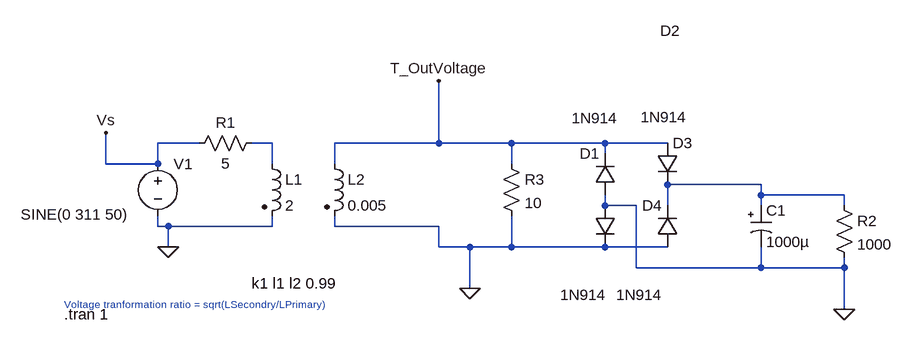
[diagram p0: schematic powersupply12V.asc]
powersupply12V.asc, the LTspice schematic file:
Version 4
SHEET 1 1608 680
WIRE 48 96 -16 96
WIRE 160 96 128 96
WIRE 416 96 416 0
WIRE 416 96 256 96
WIRE 528 96 416 96
WIRE 672 96 528 96
WIRE 768 96 672 96
WIRE 672 112 672 96
WIRE -96 128 -96 80
WIRE -16 128 -16 96
WIRE -16 128 -96 128
WIRE 160 128 160 96
WIRE 256 128 256 96
WIRE 528 128 528 96
WIRE 912 160 768 160
WIRE 912 176 912 160
WIRE 1040 176 912 176
WIRE 672 192 672 176
WIRE 720 192 672 192
WIRE 768 192 768 160
WIRE 912 192 912 176
WIRE 1040 192 1040 176
WIRE -16 224 -16 208
WIRE 0 224 -16 224
WIRE 160 224 160 208
WIRE 160 224 0 224
WIRE 256 224 256 208
WIRE 416 224 256 224
WIRE 0 256 0 224
WIRE 416 256 416 224
WIRE 464 256 416 256
WIRE 528 256 528 208
WIRE 528 256 464 256
WIRE 672 256 528 256
WIRE 768 256 672 256
WIRE 720 288 720 192
WIRE 912 288 912 256
WIRE 912 288 720 288
WIRE 1040 288 1040 272
WIRE 1040 288 912 288
WIRE 464 320 464 256
WIRE 1040 352 1040 288
FLAG 0 256 0
FLAG -96 80 Vs
FLAG 416 0 T_OutVoltage
FLAG 464 320 0
FLAG 1040 352 0
SYMBOL voltage -16 112 R0
WINDOW 3 -211 94 Left 2
WINDOW 123 0 0 Left 0
WINDOW 39 0 0 Left 0
SYMATTR Value SINE(0 311 50)
SYMATTR InstName V1
SYMBOL res 144 80 R90
WINDOW 0 0 56 VBottom 2
WINDOW 3 32 56 VTop 2
SYMATTR InstName R1
SYMATTR Value 5
SYMATTR SpiceLine tol=1 pwr=0.1
SYMBOL ind2 144 112 R0
SYMATTR InstName L1
SYMATTR Value 2
SYMATTR Type ind
SYMBOL ind2 240 112 R0
SYMATTR InstName L2
SYMATTR Value 0.005
SYMATTR Type ind
SYMBOL diode 688 176 R180
WINDOW 0 24 64 Left 2
WINDOW 3 -4 119 Left 2
SYMATTR InstName D1
SYMATTR Value 1N914
SYMBOL diode 656 192 R0
WINDOW 0 101 -269 Left 2
WINDOW 3 33 138 Left 2
SYMATTR InstName D2
SYMATTR Value 1N914
SYMBOL diode 752 96 R0
WINDOW 3 -25 -40 Left 2
SYMATTR Value 1N914
SYMATTR InstName D3
SYMBOL diode 784 256 R180
WINDOW 0 24 64 Left 2
WINDOW 3 110 -74 Left 2
SYMATTR InstName D4
SYMATTR Value 1N914
SYMBOL polcap 896 192 R0
WINDOW 3 24 56 Left 2
SYMATTR Value 1000µ
SYMATTR InstName C1
SYMATTR Description Capacitor
SYMATTR Type cap
SYMATTR SpiceLine V=16 Irms=1.17 Rser=0.046 Lser=4.82469n
SYMBOL res 512 112 R0
SYMATTR InstName R3
SYMATTR Value 10
SYMBOL res 1024 176 R0
SYMATTR InstName R2
SYMATTR Value 1000
TEXT 128 312 Left 2 !k1 l1 l2 0.99
TEXT -160 344 Left 1 ;Voltage tranformation ratio = sqrt(LSecondry/LPrimary)
TEXT -160 360 Left 2 !.tran 1

The netlist it stands for:
* powersupply12V.asc
V1 Vs 0 SINE(0 311 50)
R1 N001 Vs 5 tol=1 pwr=0.1
L1 N001 0 2
L2 T_OutVoltage 0 0.005
D1 0 T_OutVoltage 1N914
D2 0 0 1N914
D3 T_OutVoltage N002 1N914
D4 0 N002 1N914
C1 N002 0 1000µ V=16 Irms=1.17 Rser=0.046 Lser=4.82469n
R3 T_OutVoltage 0 10
R2 N002 0 1000
.model D D
.lib standard.dio
k1 l1 l2 0.99
* Voltage tranformation ratio = sqrt(LSecondry/LPrimary)
.tran 1
.backanno
.end